# EAGLE design LED_Knihovna (EAGLE 7.2.0)
AUTHOR: M. Petrilak; VERSION: 00
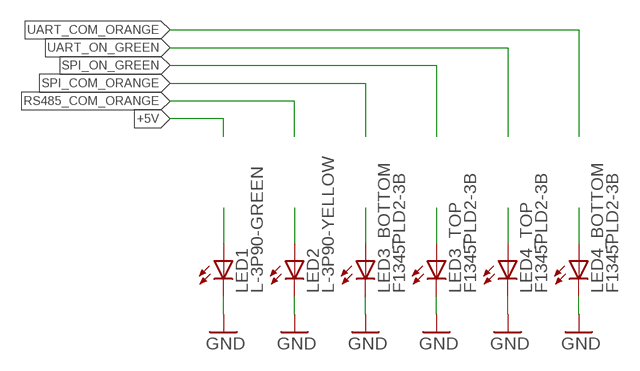
[diagram p0: schematic, sheet 1]

## Parts
LED1  L-3P90-GREEN  [L-3P90]
LED2  L-3P90-YELLOW  [L-3P90]
LED3  F1345PLD2-3B  [F1345PLD2-3B]
LED4  F1345PLD2-3B  [F1345PLD2-3B]

## Nets
GND: LED1.K(C) LED2.K(C) LED3.1K(C) LED3.2K(C) LED4.1K(C) LED4.2K(C)
N$1: LED2.A
N$2: LED1.A
N$9: LED4.1A(A)
N$10: LED4.2A(A)
N$11: LED3.2A(A)
N$12: LED3.1A(A)

## Library data of the parts
LED1 LED2 = led:L-3P90
LED3 LED4 = led:F1345PLD2-3B

## Board
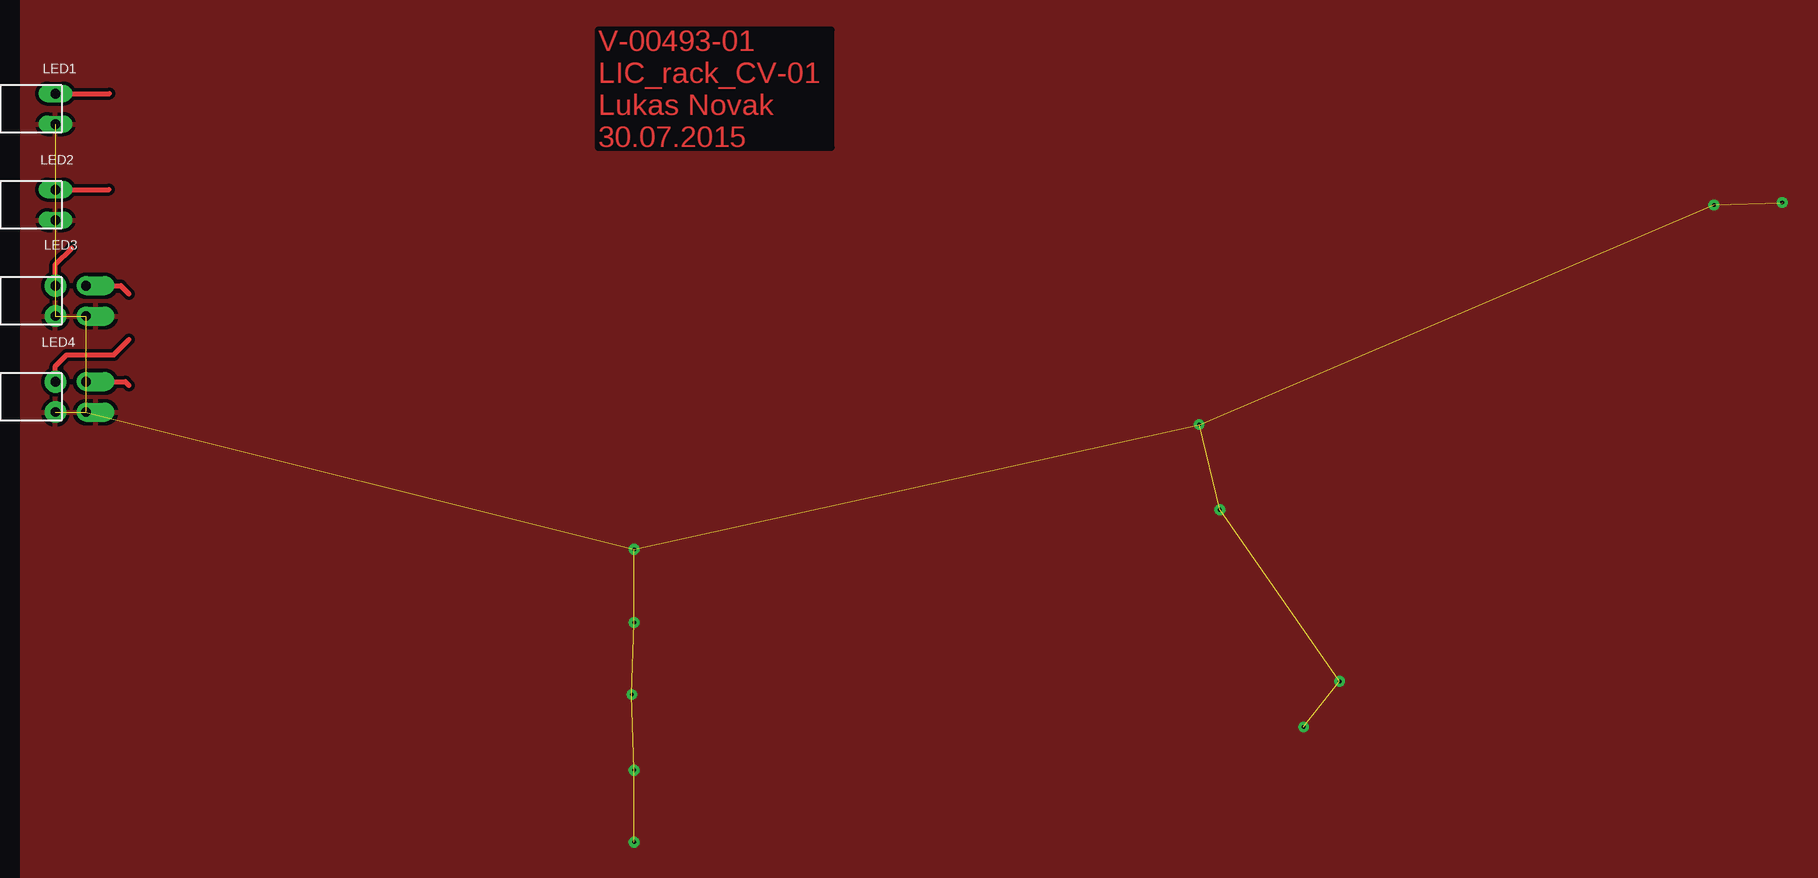
[diagram p1: board, top side]
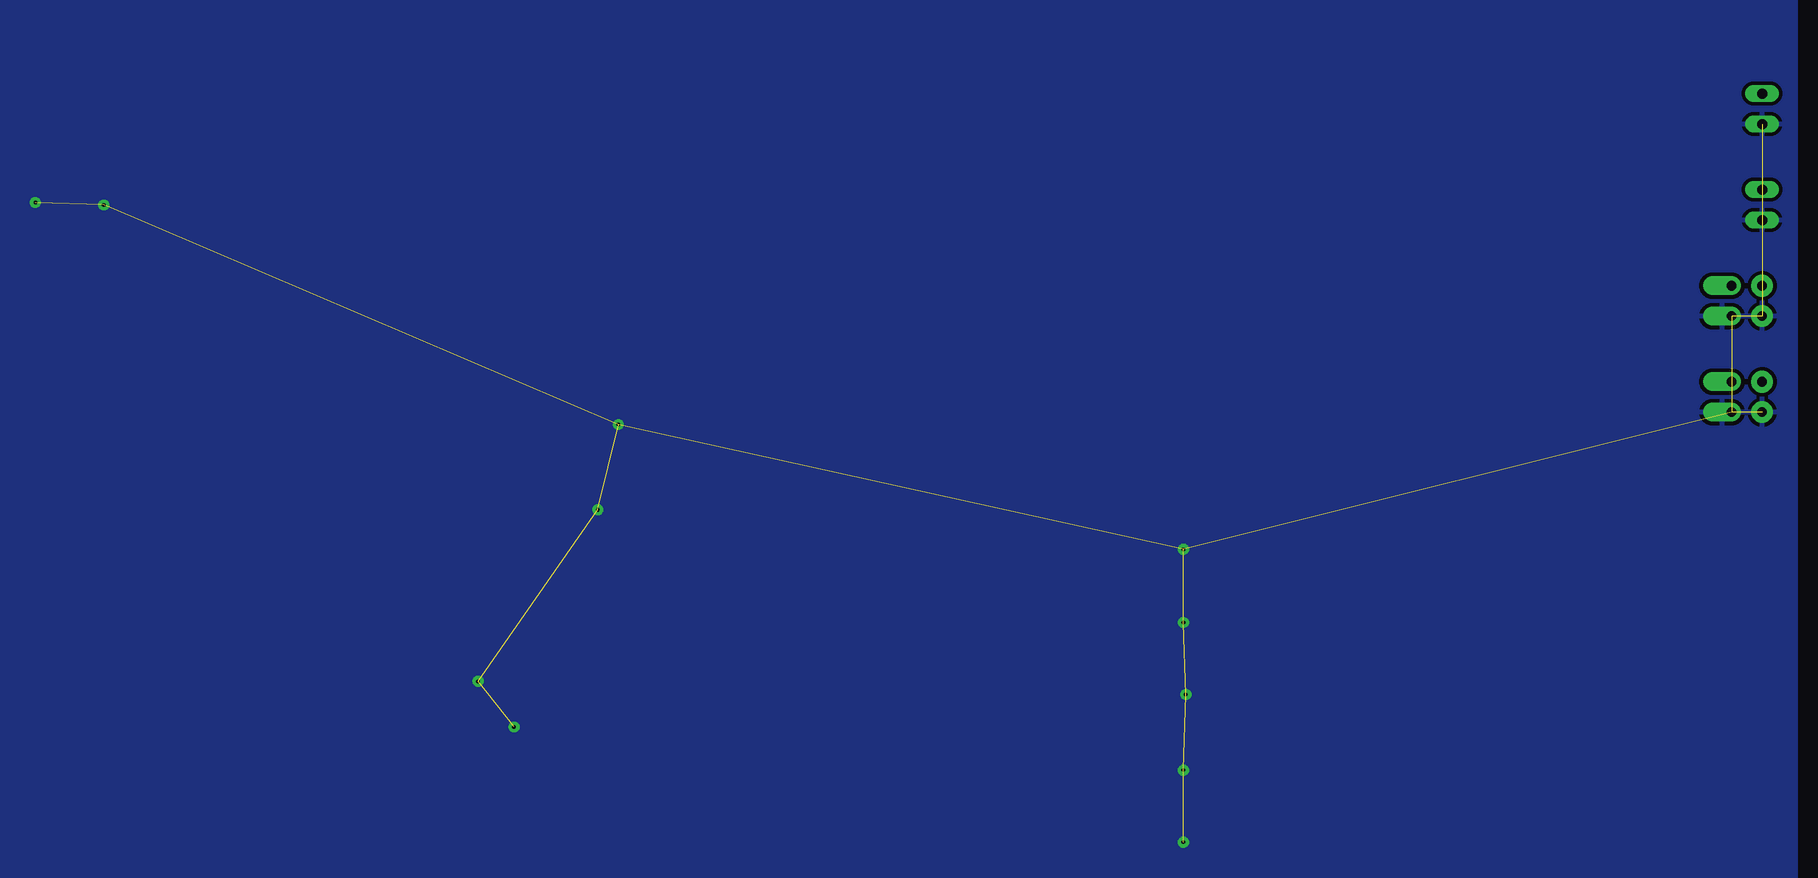
[diagram p2: board, bottom side, seen from below]

No outline drawn. Coordinates in mm, seen from the top.
Copper layers (1*16): Top 0.04mm / dielectric 1.5mm / Bottom 0.04mm
Design rules "mucha_navrh_my_fine *": minimum track width 0.2mm, minimum drill 0.3mm, track to track 0.3mm, track to pad 0.3mm, pad to pad 0.3mm, via to via 0.3mm, smd to smd 0mil, copper to edge 0.2mm, drill to drill 0.2mm, minimum pad ring 0.3mm, minimum via ring 0.3mm, stop-mask expansion 0.1mm, vias tented up to drill 0.5mm, thermal gap 0.3mm

### Footprints (pad centres in the part's own frame; a part is rotated, then mirrored left to right if it is on the bottom)
L-3P90 = drill 0.813 long: A 4.7,1.27; K 4.7,-1.27
F1345PLD2-3B = drill 0.8 pad 1.8: 1A 4.7,1.27; 1K 4.7,-1.27 | drill 0.8 pad 1.6 offset: 2A 7.24,1.27; 2K 7.24,-1.27

### Placement (x,y rotation side)
LED1  -1.94,37 0 top
LED2  -1.94,29 0 top
LED3  -1.94,21 0 top
LED4  -1.94,13 0 top

### Tracks (layer width: path | path; a pad name or v marks a point on that pad's centre or on a via)
GND  (via drill 0.3)  (16 unrouted)
  other vias: 99.82,3.6 146.7,29.2 141,29 51,0.3 51,-24.1 51,-18.1 50.8,-11.8 51,-5.8 106.8,-14.5 109.8,-10.7 98.1,10.7
  pour Bottom: 0,-50.8 160.02,-50.8 160.02,49.53 0,49.53
  pour Top: 0,-49.53 160.02,-49.53 160.02,49.53 0,49.53
N$1
  Top 0.406: LED2.A 7.23,30.27
N$2
  Top 0.406: LED1.A 7.27,38.27
N$9
  Top 0.406: 8.89,17.78 7.62,16.51 4.4,16.51 4.39,16.5 3.7,16.5 2.76,15.56 LED4.1A
N$10
  Top 0.406: LED4.2A 8.59,14.27 8.89,13.97
N$11
  Top 0.406: LED3.2A 8.21,22.27 8.89,21.59
N$12
  Top 0.406: LED3.1A 2.76,24.06 4.1,25.4

### Text on the board
Top: V-00493-01 / LIC_rack_CV-01 / Lukas Novak / 30.07.2015